# EAGLE schematic 6820-differential-interface (EAGLE 8.2.2)
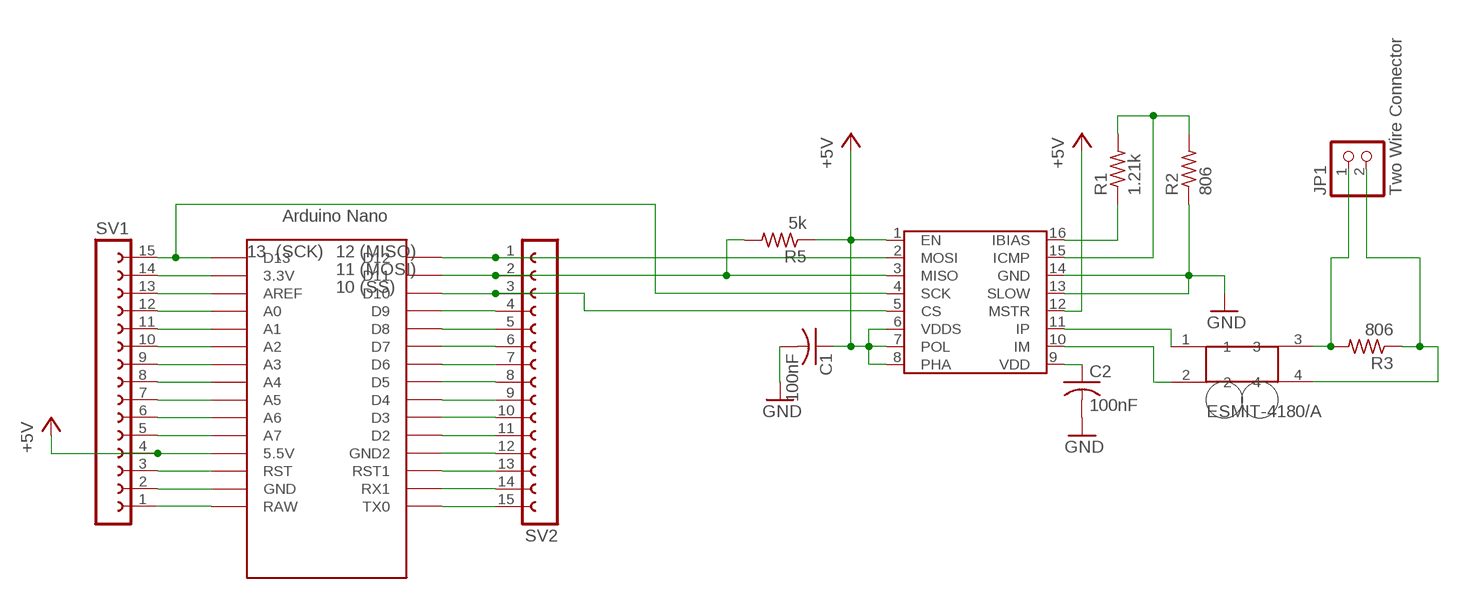
[diagram p0: schematic, sheet 1]

## Parts
C1  100nF  C-USC0805  [C0805]
C2  100nF  C-USC0805  [C0805]
JP1  Two Wire Connector  PINHD-1X2  [1X02]
R1  1.21k  R-US_R0805  [R0805]
R2  806  R-US_R0805  [R0805]
R3  806  R-US_R0805  [R0805]
R5  5k  R-US_R0805  [R0805]
SV1  FE15-1  [FE15]
SV2  FE15-1  [FE15]
U$1  NANO  [NANO]
U$2  LTC6820  [MSOP-16]
U$3  ESMIT-4180/A  [ESMIT-4180/A]

## Nets
+5V: C1.1 R5.1 SV1.4 U$1.5V(5.5V) U$2.1(EN) U$2.6(VDDS) U$2.7(POL) U$2.8(PHA) U$2.12(MSTR)
GND: C1.2 C2.2 R2.1 U$2.13(SLOW) U$2.14(GND)
N$1: R1.1 U$2.16(IBIAS)
N$2: R1.2 R2.2 U$2.15(ICMP)
N$3: SV2.1 U$1.D12 U$2.2(MOSI)
N$4: C2.1 U$2.9(VDD)
N$5: SV1.15 U$1.D13 U$2.4(SCK)
N$6: R5.2 SV2.2 U$1.D11 U$2.3(MISO)
N$7: SV1.14 U$1.3.3V
N$8: SV1.13 U$1.AREF
N$9: SV1.12 U$1.A0
N$10: SV1.11 U$1.A1
N$11: SV1.10 U$1.A2
N$12: SV1.9 U$1.A3
N$13: SV2.3 U$1.D10 U$2.5(CS)
N$14: SV2.4 U$1.D9
N$15: SV2.5 U$1.D8
N$16: SV2.6 U$1.D7
N$17: SV2.7 U$1.D6
N$18: SV2.8 U$1.D5
N$19: SV2.9 U$1.D4
N$20: SV2.10 U$1.D3
N$21: SV2.11 U$1.D2
N$22: SV2.12 U$1.GND1(GND2)
N$23: SV2.13 U$1.RST1
N$24: SV2.14 U$1.RX1
N$25: SV2.15 U$1.TX0
N$26: SV1.1 U$1.RAW
N$27: SV1.2 U$1.GND
N$28: SV1.3 U$1.RST
N$29: SV1.5 U$1.A7
N$30: SV1.6 U$1.A6
N$31: SV1.7 U$1.A5
N$32: SV1.8 U$1.A4
N$34: U$2.11(IP) U$3.1
N$35: U$2.10(IM) U$3.2
N$36: JP1.1 R3.2 U$3.3
N$37: JP1.2 R3.1 U$3.4
Unconnected: U$1.ICSP1 U$1.ICSP2 U$1.ICSP3 U$1.ICSP4 U$1.ICSP5 U$1.ICSP6

## Notes on the sheet
- 13  (SCK) | 12 (MISO)
- 11 (MOSI)
- 10 (SS)
- ESMIT-4180/A

## Library data of the parts
C1 C2 = rcl:C-US: CAPACITOR, American symbol
JP1 = pinhead:PINHD-1X2: PIN HEADER
R1-R3 R5 = rcl:R-US_: RESISTOR, American symbol
SV1 SV2 = con-lsta:FE15-1: FEMALE HEADER; OC_FARNELL: unknown; OC_NEWARK: unknown
U$1 = Arduino-clone:NANO: Arduino Nano
U$2 = HyTechDevices:LTC6820
U$3 = cool:ESMIT-4180/A